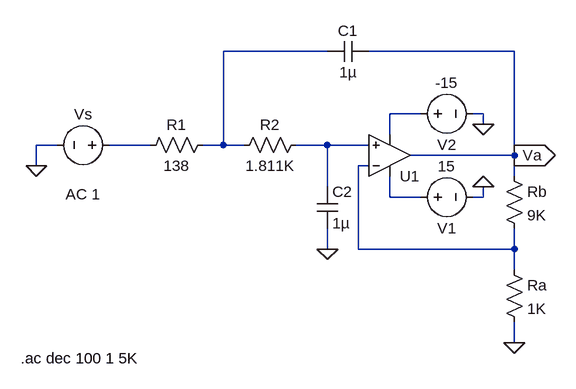
[diagram p0: schematic Run_1.asc]
Run_1.asc, the LTspice schematic file:
Version 4
SHEET 1 944 680
WIRE 288 128 128 128
WIRE 576 128 352 128
WIRE 432 224 384 224
WIRE 528 224 512 224
WIRE 528 240 528 224
WIRE 384 256 384 224
WIRE -128 272 -160 272
WIRE 16 272 -48 272
WIRE 128 272 128 128
WIRE 128 272 96 272
WIRE 160 272 128 272
WIRE 288 272 240 272
WIRE 352 272 288 272
WIRE 576 288 576 128
WIRE 576 288 416 288
WIRE -160 304 -160 272
WIRE 352 304 336 304
WIRE 576 320 576 288
WIRE 288 336 288 272
WIRE 384 352 384 320
WIRE 432 352 384 352
WIRE 528 352 528 336
WIRE 528 352 512 352
WIRE 288 432 288 400
WIRE 336 432 336 304
WIRE 576 432 576 400
WIRE 576 432 336 432
WIRE 576 464 576 432
WIRE 576 576 576 544
FLAG 528 336 0
FLAG 528 240 0
FLAG 288 432 0
FLAG -160 304 0
FLAG 576 576 0
FLAG 576 288 Va
IOPIN 576 288 Out
SYMBOL OpAmps\\UniversalOpamp2 384 288 M180
SYMATTR InstName U1
SYMBOL voltage 416 352 M90
WINDOW 0 32 56 VTop 2
WINDOW 3 -32 56 VBottom 2
WINDOW 123 0 0 Left 0
WINDOW 39 0 0 Left 0
SYMATTR InstName V1
SYMATTR Value 15
SYMBOL voltage 416 224 M90
WINDOW 0 32 56 VTop 2
WINDOW 3 -32 56 VBottom 2
WINDOW 123 0 0 Left 0
WINDOW 39 0 0 Left 0
SYMATTR InstName V2
SYMATTR Value -15
SYMBOL cap 272 336 R0
SYMATTR InstName C2
SYMATTR Value 1µ
SYMBOL res 256 256 R90
WINDOW 0 0 56 VBottom 2
WINDOW 3 32 56 VTop 2
SYMATTR InstName R2
SYMATTR Value 1.811K
SYMBOL res 112 256 R90
WINDOW 0 0 56 VBottom 2
WINDOW 3 32 56 VTop 2
SYMATTR InstName R1
SYMATTR Value 138
SYMBOL voltage -32 272 R90
WINDOW 0 -32 56 VBottom 2
WINDOW 3 32 56 VTop 2
WINDOW 123 60 56 VTop 2
WINDOW 39 0 0 Left 0
SYMATTR InstName Vs
SYMATTR Value ""
SYMATTR Value2 AC 1
SYMBOL cap 352 112 R90
WINDOW 0 0 32 VBottom 2
WINDOW 3 32 32 VTop 2
SYMATTR InstName C1
SYMATTR Value 1µ
SYMBOL res 560 304 R0
SYMATTR InstName Rb
SYMATTR Value 9K
SYMBOL res 560 448 R0
SYMATTR InstName Ra
SYMATTR Value 1K
TEXT -184 600 Left 2 !.ac dec 100 1 5K

The netlist it stands for:
* Run_1.asc
XU1 N004 N005 N006 N002 Va level.2 Avol=1Meg GBW=10Meg Slew=10Meg ilimit=25m rail=0 Vos=0 phimargin=45 en=0 enk=0 in=0 ink=0 Rin=500Meg  ; pins IN+ IN- V+ V- OUT
V1 N006 0 15
V2 N002 0 -15
C2 N004 0 1µ
R2 N004 N001 1.811K
R1 N001 N003 138
Vs N003 0 AC 1
C1 Va N001 1µ
Rb Va N005 9K
Ra N005 0 1K
.ac dec 100 1 5K
.lib UniversalOpamps2.sub
.backanno
.end